# Altium schematic sheet design_22.SchDoc: design
size 414 x 279 mm; Date: 1/25/2021 11:39:22 PM; SheetNumber: 23; Origin: Eagle; GateName_1: G$1; SymbolName_1: A3-L-GUMSTIX; LibraryName: qualified_1; DeviceSetName: A3-L-GUMSTIX; A: A; B: B; C: C; D: D; E: E; F: F; G: G; H: H; 1: 1; 2: 2; 3: 3; 4: 4; 5: 5; Sheet: Sheet:; C:/Gumstix/gumstix-logo-16.bmp: C:/Gumstix/gumstix-logo-16.bmp; Board: Board:
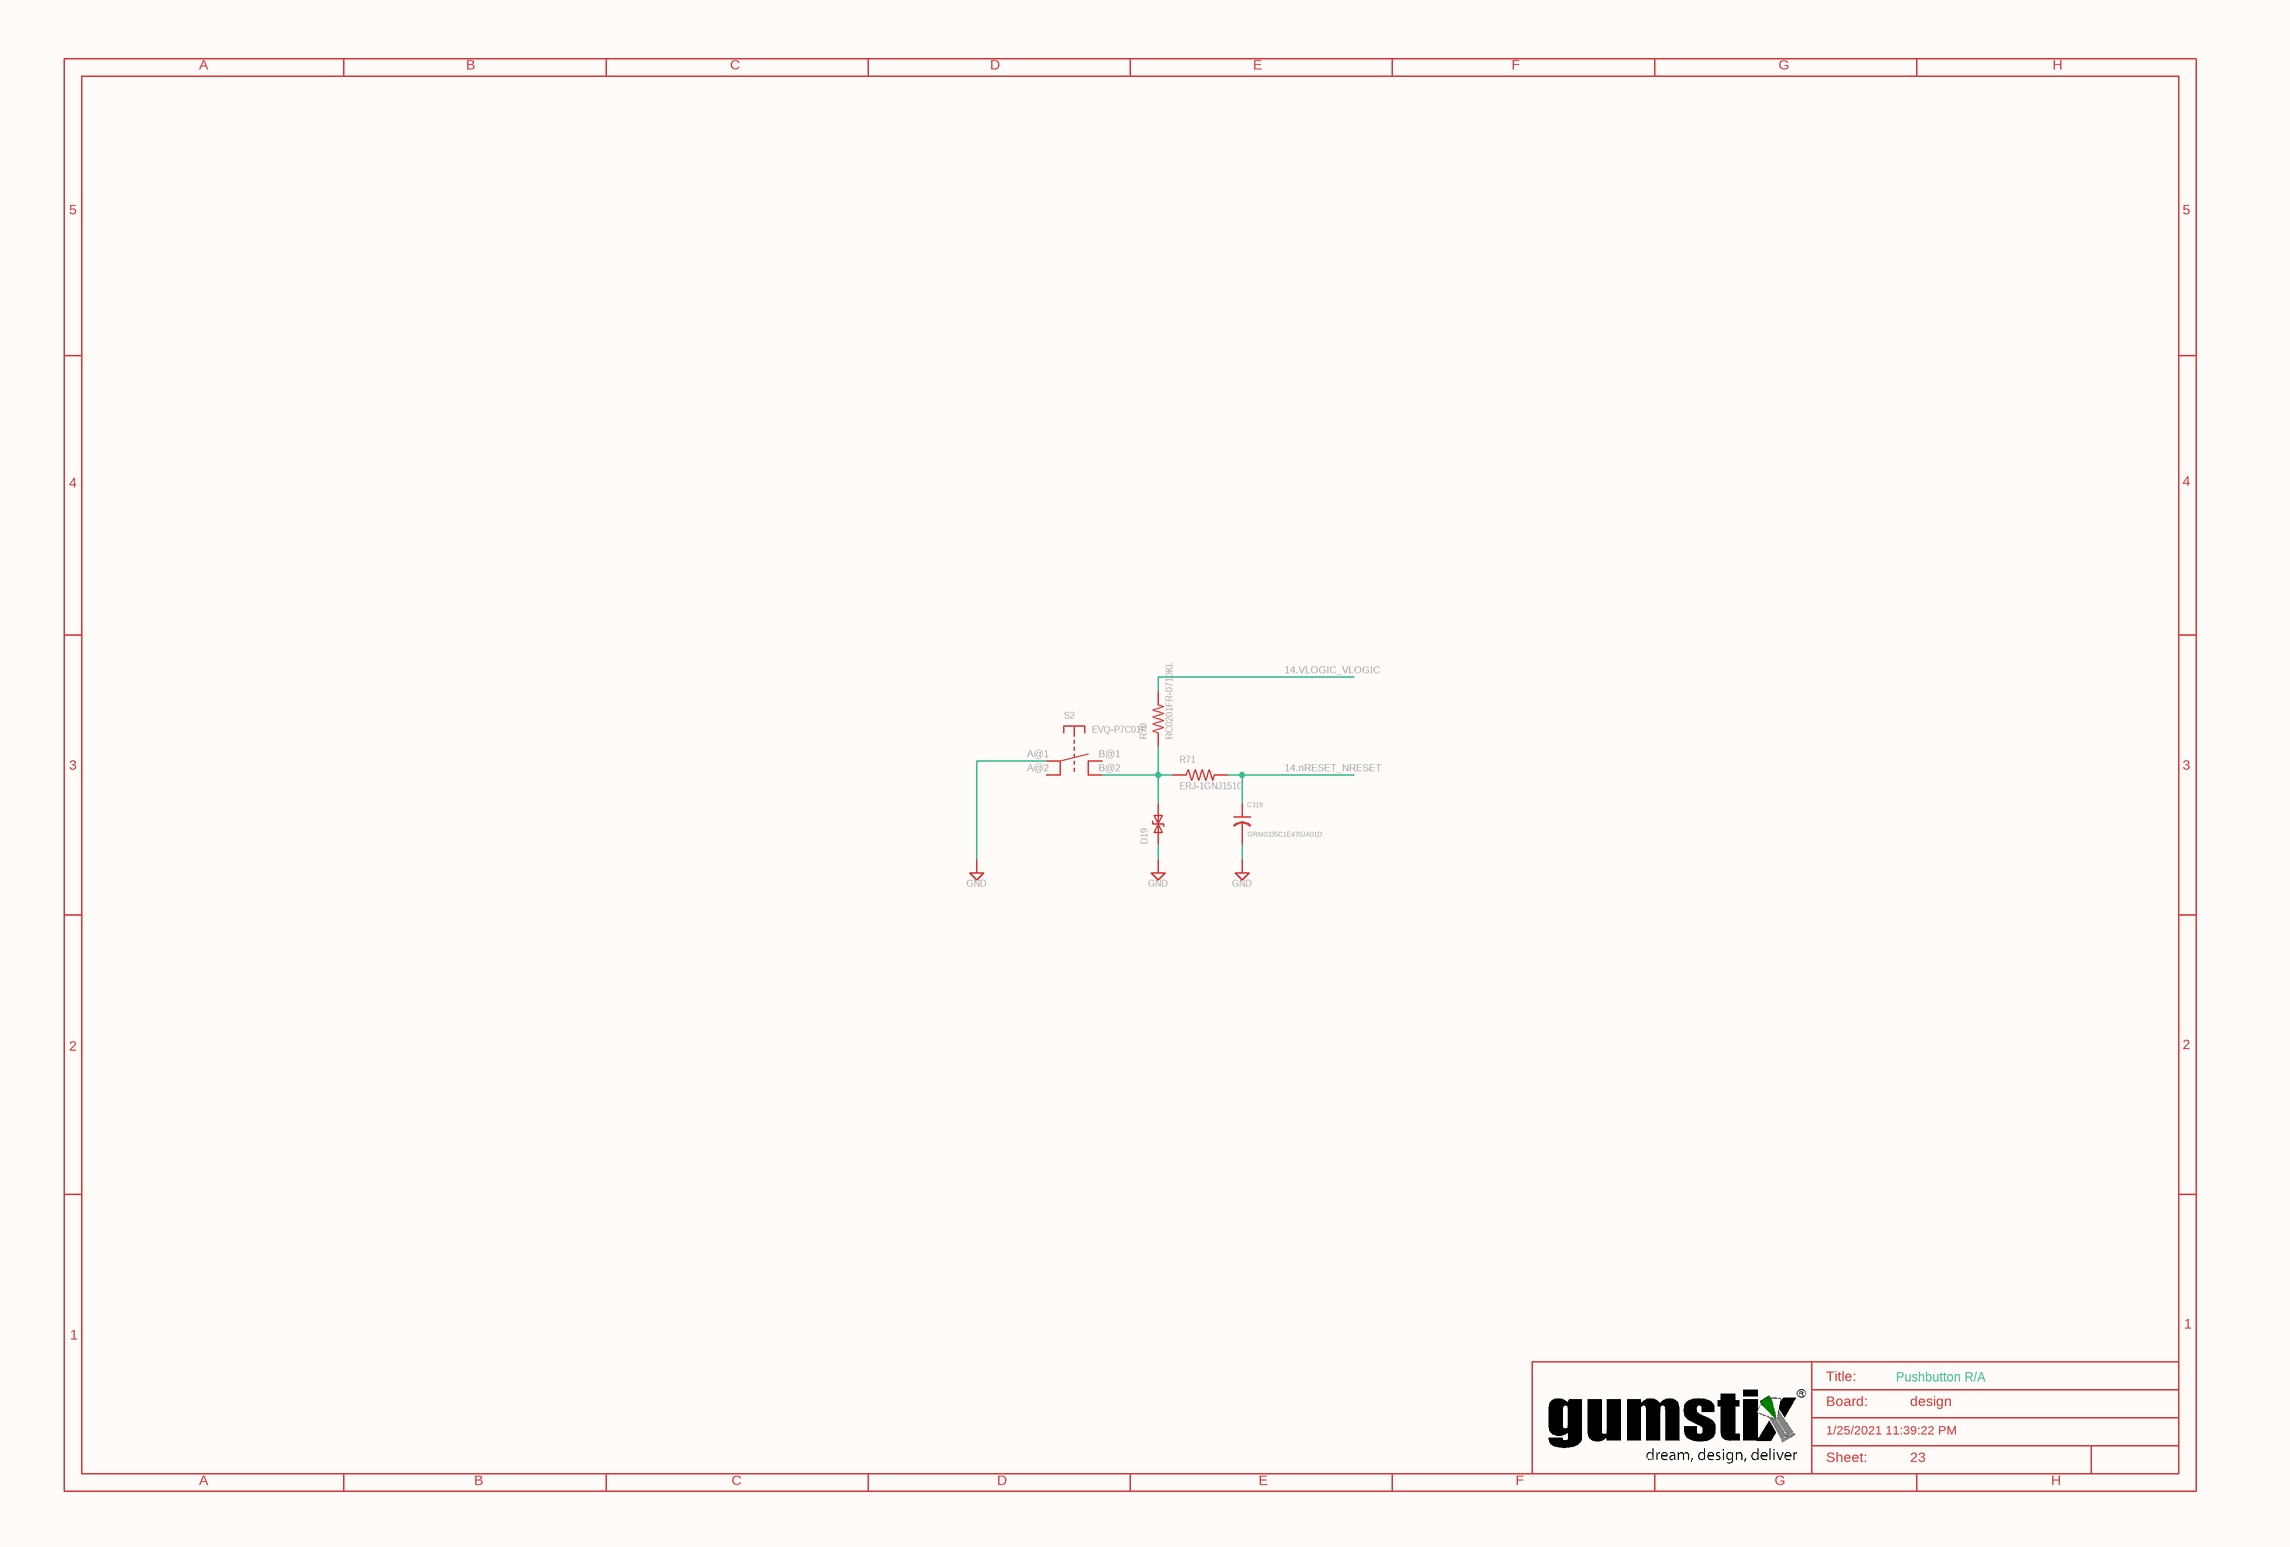
[diagram p0: design_22.SchDoc]

## Parts
C319  GRM0335C1E470JA01D  [0201]
D19  B72590D0050A060  [D0402]  (value not drawn)
R70  RC0201FR-0710KL  [0201]
R71  ERJ-1GNJ151C  [0201]
S2  EVQ-P7C01P  [EVQP-4]
SUPPLY195  GND
SUPPLY196  GND
SUPPLY197  GND

## Nets
14.nRESET_NRESET: C319.1 R71.2
14.VLOGIC_VLOGIC: R70.2
NetC319_2: C319.2 SUPPLY197.?1(GND)
NetD19_P1: D19.P1 SUPPLY196.?1(GND)
NetD19_P2: D19.P2 R70.1 R71.1 S2.B@2(B')
NetS2_A@1: S2.A@1(A) SUPPLY195.?1(GND)

Not connected (* = marked no-connect by the designer): S2 A@2(A') B@1(B)

## Notes on the sheet
- A
- B
- C
- D
- E
- F
- G
- H
- 5
- 4
- 3
- 2
- 1
- Title:
- Board:
- Pushbutton R/A
- design
- C:/Gumstix/gumstix-logo-16.bmp
- 1/25/2021 11:39:22 PM
- Sheet:
- 23

## Library data of the parts
C319 = GRM0335C1E470JA01D: GateName_1: G$1; SymbolName_1: C-US; LibraryName: qualified_1@eagle_src_repo_c6614e3cc11e779d3ff6357e0a9e972de604ed16; DeviceSetName: GRM0335C1E470JA01D; HEIGHT: 0.25
D19 = B72590D0050A060: GateName_1: G$1; SymbolName_1: ESD-DIODE; LibraryName: qualified_1; DeviceSetName: B72590D0050A060; HEIGHT: 0.35
R70 = RC0201FR-0710KL: GateName_1: G$1; SymbolName_1: R-US; LibraryName: qualified_1@eagle_src_repo_c6614e3cc11e779d3ff6357e0a9e972de604ed16; DeviceSetName: RC0201FR-0710KL; HEIGHT: 0.25
R71 = ERJ-1GNJ151C: GateName_1: G$1; SymbolName_1: R-US; LibraryName: qualified_1@eagle_src_repo_c6614e3cc11e779d3ff6357e0a9e972de604ed16; DeviceSetName: ERJ-1GNJ151C; HEIGHT: 0.25
S2 = EVQ-P7C01P: GateName_1: G$1; SymbolName_1: TS-; LibraryName: qualified_1; DeviceSetName: EVQ-P7C01P; HEIGHT: 2.5
SUPPLY195-SUPPLY197 = GND: SUPPLY SYMBOL; SymbolName_1: GND-2; GateName_1: GND; LibraryName: qualified_1; DeviceSetName: GND